# Altium project brake-box.PrjPcb
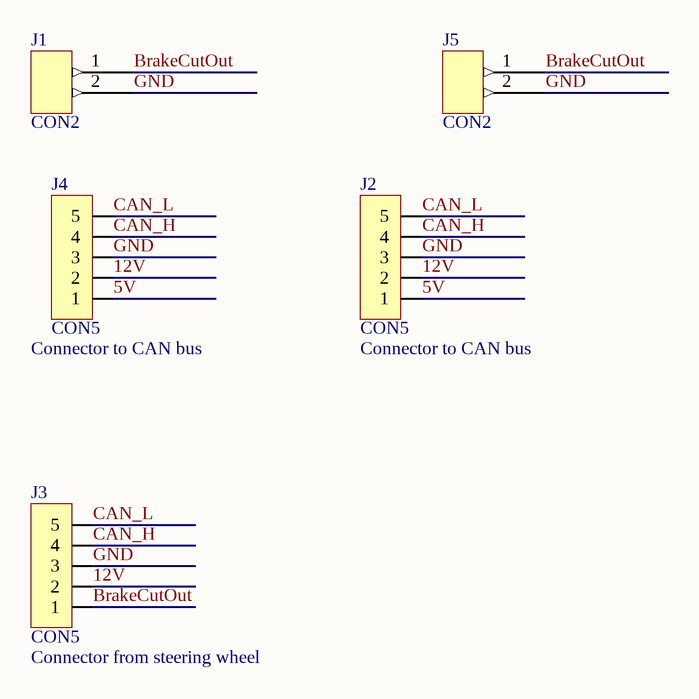
[diagram p0: brake-box.SchDoc]
1 sheet, 5 parts. Net scope: global (net labels, ports and power ports of the same name join across sheets).
Board file: brake-box.PcbDoc

## Sheet brake-box.SchDoc
size A4

### Parts
J1  CON2  [MICROFIT-2]
J2  CON5  [TRIAD5F]
J3  CON5  [TRIAD5F]
J4  CON5  [TRIAD5F]
J5  CON2  [MICROFIT-2]

### Nets
5V: J2.1 J4.1
12V: J2.2 J3.2 J4.2
BrakeCutOut: J1.1 J3.1 J5.1
CAN_H: J2.4 J3.4 J4.4
CAN_L: J2.5 J3.5 J4.5
GND: J1.2 J2.3 J3.3 J4.3 J5.2

### Notes on the sheet
- (near J4) Connector to CAN bus
- (near J2) Connector to CAN bus
- (near J3) Connector from steering wheel

### Library data of the parts
J2-J4 = CON5: Connector